# Altium schematic sheet output_drivers.SchDoc
size A4; SheetNumber: 7; SheetTotal: 8
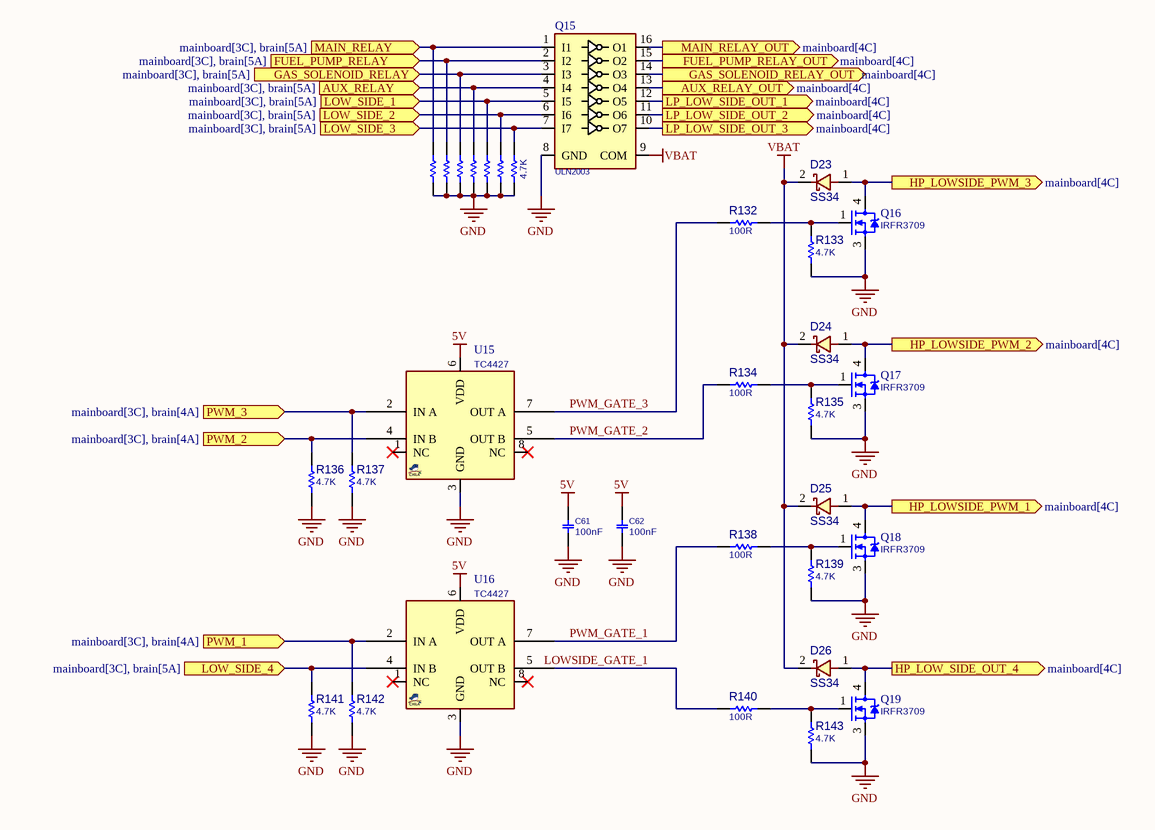
[diagram p0: output_drivers.SchDoc]

## Parts
C61  100nF  [C1206]
C62  100nF  [C1206]
D23  SS34  [D_SMB]
D24  SS34  [D_SMB]
D25  SS34  [D_SMB]
D26  SS34  [D_SMB]
Q15  ULN2003  [SO_16_W]
Q16  IRFR3709  [DPAK_3]
Q17  IRFR3709  [DPAK_3]
Q18  IRFR3709  [DPAK_3]
Q19  IRFR3709  [DPAK_3]
R125  4.7K  [R0805]  (value not drawn)
R126  4.7K  [R0805]  (value not drawn)
R127  4.7K  [R0805]  (value not drawn)
R128  4.7K  [R0805]  (value not drawn)
R129  4.7K  [R0805]  (value not drawn)
R130  4.7K  [R0805]  (value not drawn)
R131  4.7K  [R0805]
R132  100R  [R0805]
R133  4.7K  [R0805]
R134  100R  [R0805]
R135  4.7K  [R0805]
R136  4.7K  [R0805]
R137  4.7K  [R0805]
R138  100R  [R0805]
R139  4.7K  [R0805]
R140  100R  [R0805]
R141  4.7K  [R0805]
R142  4.7K  [R0805]
R143  4.7K  [R0805]
U15  TC4427  [SO_8]
U16  TC4427  [SO_8]

## Ports
AUX_RELAY (in, see mainboard[3C], brain[5A]), AUX_RELAY_OUT (out, see mainboard[4C]), FUEL_PUMP_RELAY (in, see mainboard[3C], brain[5A]), FUEL_PUMP_RELAY_OUT (out, see mainboard[4C]), GAS_SOLENOID_RELAY (in, see mainboard[3C], brain[5A]), GAS_SOLENOID_RELAY_OUT (out, see mainboard[4C]), HP_LOW_SIDE_OUT_4 (out, see mainboard[4C]), HP_LOWSIDE_PWM_1 (out, see mainboard[4C]), HP_LOWSIDE_PWM_2 (out, see mainboard[4C]), HP_LOWSIDE_PWM_3 (out, see mainboard[4C]), LOW_SIDE_1 (in, see mainboard[3C], brain[5A]), LOW_SIDE_2 (in, see mainboard[3C], brain[5A]), LOW_SIDE_3 (in, see mainboard[3C], brain[5A]), LOW_SIDE_4 (in, see mainboard[3C], brain[5A]), LP_LOW_SIDE_OUT_1 (out, see mainboard[4C]), LP_LOW_SIDE_OUT_2 (out, see mainboard[4C]), LP_LOW_SIDE_OUT_3 (out, see mainboard[4C]), MAIN_RELAY (in, see mainboard[3C], brain[5A]), MAIN_RELAY_OUT (out, see mainboard[4C]), PWM_1 (in, see mainboard[3C], brain[4A]), PWM_2 (in, see mainboard[3C], brain[4A]), PWM_3 (in, see mainboard[3C], brain[4A])

## Nets
5V: C61.2 C62.2 U15.6(VDD) U16.6(VDD)
GND: C61.1 C62.1 Q15.8(GND) Q16.3(S) Q17.3(S) Q18.3(S) Q19.3(S) R125.1 R126.1 R127.1 R128.1 R129.1 R130.1 R131.1 R133.1 R135.1 R136.1 R137.1 R139.1 R141.1 R142.1 R143.1 U15.3(GND) U16.3(GND)
VBAT: D23.2 D24.2 D25.2 D26.2 Q15.9(COM)
AUX_RELAY: Q15.4(I4) R128.2 ; port AUX_RELAY
AUX_RELAY_OUT: Q15.13(O4) ; port AUX_RELAY_OUT
FUEL_PUMP_RELAY: Q15.2(I2) R126.2 ; port FUEL_PUMP_RELAY
FUEL_PUMP_RELAY_OUT: Q15.15(O2) ; port FUEL_PUMP_RELAY_OUT
GAS_SOLENOID_RELAY: Q15.3(I3) R127.2 ; port GAS_SOLENOID_RELAY
GAS_SOLENOID_RELAY_OUT: Q15.14(O3) ; port GAS_SOLENOID_RELAY_OUT
HP_LOW_SIDE_OUT_4: D26.1 Q19.4(D) ; port HP_LOW_SIDE_OUT_4
HP_LOWSIDE_PWM_1: D25.1 Q18.4(D) ; port HP_LOWSIDE_PWM_1
HP_LOWSIDE_PWM_2: D24.1 Q17.4(D) ; port HP_LOWSIDE_PWM_2
HP_LOWSIDE_PWM_3: D23.1 Q16.4(D) ; port HP_LOWSIDE_PWM_3
LOW_SIDE_1: Q15.5(I5) R129.2 ; port LOW_SIDE_1
LOW_SIDE_2: Q15.6(I6) R130.2 ; port LOW_SIDE_2
LOW_SIDE_3: Q15.7(I7) R131.2 ; port LOW_SIDE_3
LOW_SIDE_4: R141.2 U16.4(IN_B) ; port LOW_SIDE_4
LOWSIDE_GATE_1: R140.2 U16.5(OUT_B)
LP_LOW_SIDE_OUT_1: Q15.12(O5) ; port LP_LOW_SIDE_OUT_1
LP_LOW_SIDE_OUT_2: Q15.11(O6) ; port LP_LOW_SIDE_OUT_2
LP_LOW_SIDE_OUT_3: Q15.10(O7) ; port LP_LOW_SIDE_OUT_3
MAIN_RELAY: Q15.1(I1) R125.2 ; port MAIN_RELAY
MAIN_RELAY_OUT: Q15.16(O1) ; port MAIN_RELAY_OUT
PWM_1: R142.2 U16.2(IN_A) ; port PWM_1
PWM_2: R136.2 U15.4(IN_B) ; port PWM_2
PWM_3: R137.2 U15.2(IN_A) ; port PWM_3
PWM_GATE_1: R138.2 U16.7(OUT_A)
PWM_GATE_2: R134.2 U15.5(OUT_B)
PWM_GATE_3: R132.2 U15.7(OUT_A)
NetQ16_1: Q16.1(G) R132.1 R133.2
NetQ17_1: Q17.1(G) R134.1 R135.2
NetQ18_1: Q18.1(G) R138.1 R139.2
NetQ19_1: Q19.1(G) R140.1 R143.2

Not connected (* = marked no-connect by the designer): U15 1(NC)* 8(NC)*; U16 1(NC)* 8(NC)*

## Library data of the parts
C61 C62 = CAP_SMD_MLCC: CAP, MLCC; PARAM: C0G, 10%; DESC: CAP, MLCC, 1nF, 50V, C0G, 10%, 0402; MANF_P#: MANF_PART#; MANF: Murata; PARAM2: 50V; PRICE: 100= 1$; ASSEMBLY: ASSEMBLY; VALUE: 100nF
D23-D26 = DIODE_SMD_SCHOTTKY_SS34: DIODE, SCHOTTKY, 20V, 3A; MANF: VISHAY; DESC: DESCRIPTION; MANF_P#: SS34; ASSEMBLY: ASSEMBLY; PRICE: PRICE; PARAM2: 3A; PARAM: 20V; VALUE: SS34
Q15 = ULN2003_SOP16: Darlington, 7-CH, 50V, 0.5A; MANF_P#: ULN2003A; MANF: DIODES; PARAM: 7-CH, 50V, 0.5A; PARAM2: -; VALUE: ULN2003
Q16-Q19 = MOSN_IRFR3709_DPAK: MOSFET, N-CH, 30V, 86A, 6.5mRDS, 2300pF; DESC: HEXFET Power MOSFET; MANF_P#: IRFR3709Z; PARAM2: 30VDS, 1.3~2.2VGSth; PARAM: 86A, 6.5mRDS, 2300pF, -55~175oC; ASSEMBLY: ASSEMBLY; PRICE: 1500t@PAYA; VALUE: IRFR3709
R125-R143 = RES_SMD_0805: RESISTOR, SMD; PARAM: -W; DESC: DESCRIPTION; DIST#: MOUSER; PARAM2: 1%; MANF_P#: -; MANF: -; ASSEMBLY: ASSEMBLY; PRICE: 100= 0.5$
  R125-R131 R133 R135-R137 R139 R141-R143: VALUE: 4.7K
  R132 R134 R138 R140: VALUE: 100R
U15 U16 = MOS_DUAL_TC4427: power Mosfet Driver, Dual, High-Speed, 1.5A; ASSEMBLY: ASSEMBLY; MANF_P#: TC4427; VALUE: TC4427